# Altium project Codec.PrjPcb
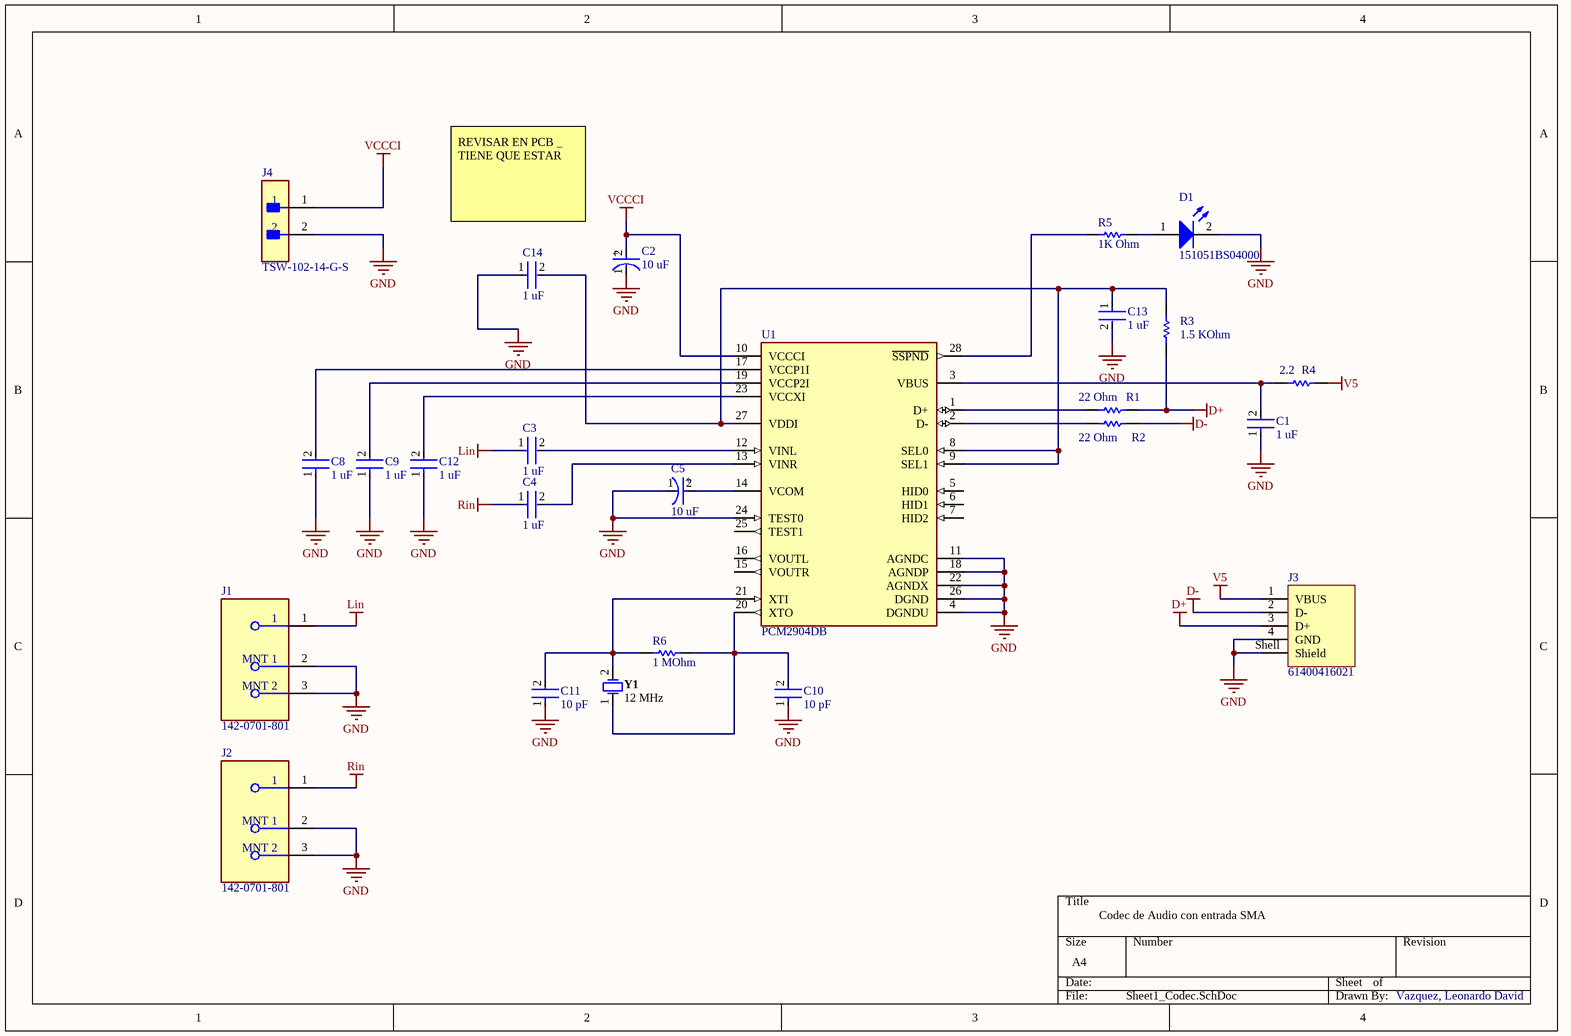
[diagram p0: Sheet1_Codec.SchDoc]
1 sheet, 25 parts. Net scope: global (net labels, ports and power ports of the same name join across sheets).
Board file: CODEC.PcbDoc

## Sheet Sheet1_Codec.SchDoc
size A4; SheetNumber: 1; SheetTotal: 1

### Parts
C1  1 uF  [FP-CC0805-0_85-MFG]
C2  10 uF  [FP-RAD-TH-D_6_3_0_5-L_7_1-MFG]
C3  1 uF  [FP-CC0805-0_85-MFG]
C4  1 uF  [FP-CC0805-0_85-MFG]
C5  10 uF  [FP-RAD-TH-D_6_3_0_5-L_7_1-MFG]
C8  1 uF  [FP-CC0805-0_85-MFG]
C9  1 uF  [FP-CC0805-0_85-MFG]
C10  10 pF  [FP-CC0805-0_85-MFG]
C11  10 pF  [FP-CC0805-0_85-MFG]
C12  1 uF  [FP-CC0805-0_85-MFG]
C13  1 uF  [FP-CC0805-0_85-MFG]
C14  1 uF  [FP-CC0805-0_85-MFG]
D1  151051BS04000  [WL-TMRC_D5.9H8.7]
J1  142-0701-801  [FP-142-0701-801-MFG]
J2  142-0701-801  [FP-142-0701-801-MFG]
J3  61400416021  [61400416021]
J4  TSW-102-14-G-S  [FP-TSW-102-14-G-S-MFG]
R1  22 Ohm  [RESC2013X60X40ML20T25]
R2  22 Ohm  [RESC2013X60X40ML20T25]
R3  1.5 KOhm  [RESC2013X60X40ML20T25]
R4  2.2  [RESC2013X60X40ML20T25]
R5  1K Ohm  [RESC2013X60X40ML20T25]
R6  1 MOhm  [RESC2013X60X40ML20T25]
U1  PCM2904DB  [FP-DB0028A-IPC_A]
Y1  12 MHz  [FOX-FOXSLF160-20]

### Nets
D+: J3.3(D+) R1.1 R3.2
D-: J3.2(D-) R2.2
GND: C1.1 C2.1(C) C5.1(C) C8.1 C9.1 C10.1 C11.1 C12.1 C13.2 C14.1 D1.2(K) J1.2(MNT_1) J1.3(MNT_2) J2.2(MNT_1) J2.3(MNT_2) J3.4(GND) J3.Shell(Shield) J4.2 U1.4(DGNDU) U1.11(AGNDC) U1.18(AGNDP) U1.22(AGNDX) U1.24(TEST0) U1.26(DGND)
Lin: C3.1 J1.1
Rin: C4.1 J2.1
V5: J3.1(VBUS) R4.1
VCCCI: C2.2(A) J4.1 U1.10(VCCCI)
NetC1_2: C1.2 R4.2 U1.3(VBUS)
NetC3_2: C3.2 U1.12(VINL)
NetC4_2: C4.2 U1.13(VINR)
NetC5_2: C5.2(A) U1.14(VCOM)
NetC8_2: C8.2 U1.17(VCCP1I)
NetC9_2: C9.2 U1.19(VCCP2I)
NetC10_2: C10.2 R6.2 U1.20(XTO) Y1.1
NetC11_2: C11.2 R6.1 U1.21(XTI) Y1.2
NetC12_2: C12.2 U1.23(VCCXI)
NetC13_1: C13.1 C14.2 R3.1 U1.8(SEL0) U1.9(SEL1) U1.27(VDDI)
NetD1_1: D1.1(A) R5.1
NetR1_2: R1.2 U1.1(D+)
NetR2_1: R2.1 U1.2(D-)
NetR5_2: R5.2 U1.28(~{SSPND})

Not connected (* = marked no-connect by the designer): U1 5(HID0) 6(HID1) 7(HID2) 15(VOUTR) 16(VOUTL) 25(TEST1)

### Notes on the sheet
- REVISAR EN PCB _ TIENE QUE ESTAR
- Codec de Audio con entrada SMA
- Vazquez, Leonardo David
- (in symbol CMP-05427-001316-1) +

### Library data of the parts
C1 C3 C4 C8-C14 = CMP-2100-03606-3: CAP CER 0.1UF 50V X7R 0805; Manufacturer Part Number: CC0805KRX7R9BB104; Manufacturer: Yageo; Tolerance: 0.1; Capacitance: 100 nF; Value: 100 nF; Material: Ceramic; Device Class L1: Passive Components; ComponentLink2Description: Datasheet; Package: CC0805-0.85; Digikey Description: CAP CER 0.1UF 50V X7R 0805; Device Class L3: Ceramic Capacitors; Temperature: -30°C to +85°C; Temperature Characteristic: X7R; Voltage Rating: 50 V; Height: 0.95mm; RoHS: TRUE; Ipc Land Pattern Name: CAPC200125X85; Device Class L2: Capacitors; Category: Cap; Temperature Range Low: -30°C; Temperature Range High: +85°C; Mouser Description: Multilayer Ceramic Capacitors MLCC - SMD/SMT 100nF 50V X7R 10%; Footprint Url: http://www.yageo.com/exep/pages/download/literatures/UPY-C_GEN_24.pdf; Automotive: No; Octopart: https://octopart.com/cc0805krx7r9bb104-yageo-192993; Lead Free: Yes; ComponentLink2URL: http://www.yageo.com/documents/recent/UPY-GPHC_Y5V_6.3V-to-50V_8.pdf
C2 C5 = CMP-05427-001316-1: Aluminum Electrolytic Capacitors (Radial Lead Type) 100uF ±20% 16V; Life (Hours): 1000Hour; Lead Diameter: 0.45mm; Polarity: Polar; Ripple Current: 91mA; Series: KA; Packaging: Tape and Reel; Voltage Rating: 16V; Voltage Rating (DC): 16V; Min Operating Temperature: -40°C; Lead Pitch: 2.5mm; Mount: Through Hole; Height - Seated (Max): 0.315inch; Package Quantity: 2000; Length: 7mm; Termination: Radial; Voltage: 16V; Diameter: 6.3mm; Height: 7mm; Radiation Hardening: No; RoHS Compliant: Yes; Tolerance: 20%; Capacitance: 100uF; Case/Package: Radial; Max Operating Temperature: 85°C
D1 = CMP-1488-00009-2: NexarPartId: 29717812; Test Current: 20mA; Forward Voltage: 3.2V; Wavelength: 470nm; Lens Size: 5mm; Lens Style: Circular, Diffused, Round; Forward Current: 100mA; Peak Wavelength: 465nm; Viewing Angle: 40°; Luminous Intensity: 500mcd; Max Reverse Voltage (DC): 5V; Color: Blue; Case/Package: Radial; Width: 5mm; Mount: Through Hole; Min Operating Temperature: -40°C; Length: 5mm; Height: 8.6mm; Max Operating Temperature: 85°C; Packaging: Bulk; RoHS: Compliant; REACH SVHC: Unknown; Dominant Wavelength: 470nm
J1 J2 = CMP-09588-000002-1: CONN SMA JACK STR 50OHM EDGE MNT; Frequency: 18GHz; Operating Frequency: 0 to 18 GHz; Body Material: Brass; Impedance: 50R; Voltage Rating: 335V; Gender: Female; Body Plating: Gold; Orientation: Straight; Length: 0.44inch; Max Operating Temperature: 165°C; Package Quantity: 5; Packaging: Bulk; Series: SMA; Contact Material: Copper; Min Operating Temperature: -65°C; Depth: 25.58mm; RoHS Compliant: Yes; Case/Package: SMA; Max Frequency: 18GHz; Radiation Hardening: No; Contact Plating: Gold; Mount: Edge; Connector Type: SMA; Fastening Type: Threaded; Termination: Solder
J3 = CMP-1502-03227-2: NexarPartId: 21041530; Contact Resistance: 20mΩ; Gender: Receptacle; Voltage Rating (DC): 30V; Current Rating: 1.5A; Connector Type: USB; Insulation Resistance: 1GΩ; USB Standard: USB 2.0; Number of Contacts: 4; Number of Ports: 1; Width: 14.4mm; REACH SVHC: Unknown; Contact Plating: Gold; Length: 15.8mm; Lead Free: Lead Free; Max Operating Temperature: 105°C; Orientation: Horizontal; Contact Material: Copper; Voltage Rating: 30V; Min Operating Temperature: -40°C; Flammability Rating: UL94 V-0; Color: White; RoHS: Compliant; Number of Pins: 4; Mount: Horizontal, Through Hole; Number of Positions: 4; Operating Supply Voltage: 30V; Insulation Material: PBT; Termination: Solder
J4 = CMP-02766-001740-1: CONN HEADER VERT 2POS 2.54MM; Number of Positions: 2; Max Current Rating: 7.6A; Gender: Male; Max Voltage Rating (AC): 550V; Contact Mating Length: 0.32inch; REACH SVHC: No SVHC; Width: 2.54mm; Insulation Material: PBT; Contact Shape: Square; Contact Plating: Gold; Min Operating Temperature: -55°C; Contact Material: Bronze; Color: Black; Number of Contacts: 2; Housing Material: Polyester; Orientation: Straight; Flammability Rating: UL94 V-0; Max Operating Temperature: 125°C; Contact Type: Male Pin; Radiation Hardening: No; Termination: Solder; RoHS Compliant: Yes; Lead Free: Lead Free; Fastening Type: Pull; Pitch: 2.54mm; Number of Rows: 1; Series: TSW; Insulation Color: Black; Package Quantity: 1; Connector Type: Header; Length: 5.08mm; Contact Finish - Mating: GOLD; Mount: Through Hole; Housing Color: Black; Depth: 2.54mm; Packaging: Bulk
R1-R6 = CMP-2001-00580-1: Manufacturer: Panasonic; Part Number: ERA6AEB101V
U1 = CMP-04873-000006-1: IC STEREO AUD CODEC W/USB 28SSOP; Max Supply Voltage: 5.25V; Number of Analog Outputs: 2; Operating Supply Voltage: 5V; Number of A/D Converters: 1; Min Supply Voltage: 3.25V; Resolution: 16b; Nominal Supply Current: 67mA; Number of Bits: 16; Sampling Rate: 48KS/s; Signal to Noise Ratio (SNR): 89dB; Interface: USB; Width: 5.3mm; Length: 10.2mm; Radiation Hardening: No; Weight: 0.010081oz; Height: 1.95mm; Mount: Surface Mount; Number of Analog Inputs: 2; RoHS Compliant: Yes; Lead Free: Lead Free; Number of DAC Channels: 2; Max Operating Temperature: 85°C; Number of Channels: 2; Number of Pins: 28; Packaging: Rail/Tube; Case/Package: SSOP; Number of ADC Channels: 2; Number of D/A Converters: 1; Min Operating Temperature: -25°C; Package Quantity: 47; Type: General Purpose
Y1 = CMP-1749-00003-1: Resistance Weld Thru-Hole Crystal, 16 MHz, -20 to 70 degC, 2-Pin THD, RoHS, Bulk; Voltage Rating: 250 V; Tolerance: 1%; Resistance: 221 kohm; Case\Package: Axial; Power Rating: 250 mW; RoHSCompliant: true; Package Quantity: 200; Packaging: Bulk; Min Operating Temperature: -55 degC; DatasheetVersion: Mar-15; ComponentLink1URL: http://www.foxonline.com/; Max Operating Temperature: 155 degC; PackageReference: FOXSLF160-20; Mount: Through Hole; PackageDescription: 2-Pin Through Hole Device, Body 11.35 x 4.65 mm; ComponentLink1Description: Manufacturer URL; ComponentLink2URL: http://www.foxonline.com/pdfs/hc49slf.pdf; ComponentLink2Description: Datasheet; Length: 0.248 inch